# EAGLE schematic dome-board4 (EAGLE 7.2.0)
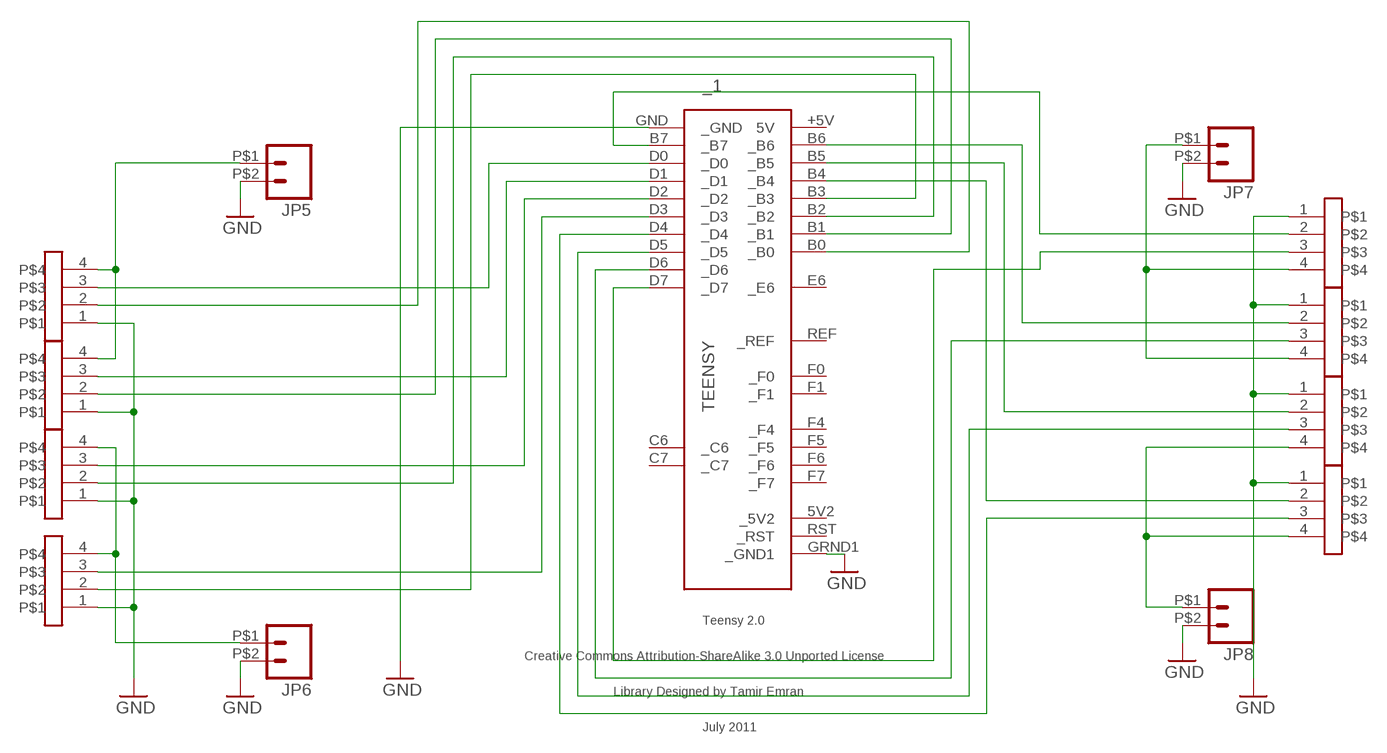
[diagram p0: schematic, sheet 1]

## Parts
_1  TEENSY  [TEENSY]
JP5  M026.35MM  [SCREWTERMINAL-6.35MM-2]
JP6  M026.35MM  [SCREWTERMINAL-6.35MM-2]
JP7  M026.35MM  [SCREWTERMINAL-6.35MM-2]
JP8  M026.35MM  [SCREWTERMINAL-6.35MM-2]
U$1  M04  [1X04-2EDG-350]
U$2  M04  [1X04-2EDG-350]
U$3  M04  [1X04-2EDG-350]
U$4  M04  [1X04-2EDG-350]
U$5  M04  [1X04-2EDG-350]
U$6  M04  [1X04-2EDG-350]
U$7  M04  [1X04-2EDG-350]
U$8  M04  [1X04-2EDG-350]

## Nets
GND: _1.GND(_GND) _1.GRND1(_GND1) JP5.P$2 JP6.P$2 JP7.P$2 JP8.P$2 U$1.1 U$2.1 U$3.1 U$4.1 U$5.1 U$6.1 U$7.1 U$8.1
N$1: _1.B0(_B0) U$1.2
N$2: _1.B1(_B1) U$2.2
N$3: _1.B2(_B2) U$3.2
N$4: _1.B3(_B3) U$4.2
N$5: _1.B4(_B4) U$8.2
N$6: _1.B5(_B5) U$7.2
N$7: _1.B6(_B6) U$6.2
N$9: _1.D0(_D0) U$1.3
N$10: _1.D1(_D1) U$2.3
N$11: _1.D2(_D2) U$3.3
N$12: _1.D3(_D3) U$4.3
N$13: _1.D4(_D4) U$8.3
N$14: _1.D5(_D5) U$7.3
N$15: _1.D6(_D6) U$6.3
N$16: _1.D7(_D7) U$5.3
N$20: _1.B7(_B7) U$5.2
VCC1: JP5.P$1 U$1.4 U$2.4
VCC2: JP7.P$1 U$5.4 U$6.4
VCC3: JP6.P$1 U$3.4 U$4.4
VCC4: JP8.P$1 U$7.4 U$8.4
Unconnected: _1.5V2(_5V2) _1.+5V(5V) _1.C6(_C6) _1.C7(_C7) _1.E6(_E6) _1.F0(_F0) _1.F1(_F1) _1.F4(_F4) _1.F5(_F5) _1.F6(_F6) _1.F7(_F7) _1.REF(_REF) _1.RST(_RST)

## Library data of the parts
_1 = teensy:TEENSY: Teensy 2.0 Original Design by Clint Fisher Modified Design by Tamir Emran Licensed Under Creative Commons Attribution-ShareAlike 3.0 Unported (CC BY-SA 3.0)
JP5-JP8 = SparkFun:M02: Header 2 Standard 2-pin 0.1" header. Use with straight break away headers (SKU : PRT-00116), right angle break away headers (PRT-00553), swiss pins (PRT-00743), machine pins (PRT-00117), and female headers (PRT-00115). Molex polarized connector foot print use with SKU : PRT-08233 with associated crimp pins and housings.
U$1-U$8 = blinkinlabs:M04

## Net classes
0 default: width 0.305 mm, clearance 0.305 mm
1 power: width 3.124 mm, clearance 0.635 mm